# EasyEDA Pro project MSDRv2.eprj, schematic Schematic1_1
Board Name: 4xAGCV1.1; Create Date: 2025-01-03; Page Name: P1; Project Name: 4xAGCV1; Schematic Name: Schematic1; Update Date: 2025-01-03; Company: EasyEDA.com; Page Size: A4; Version: V1.0
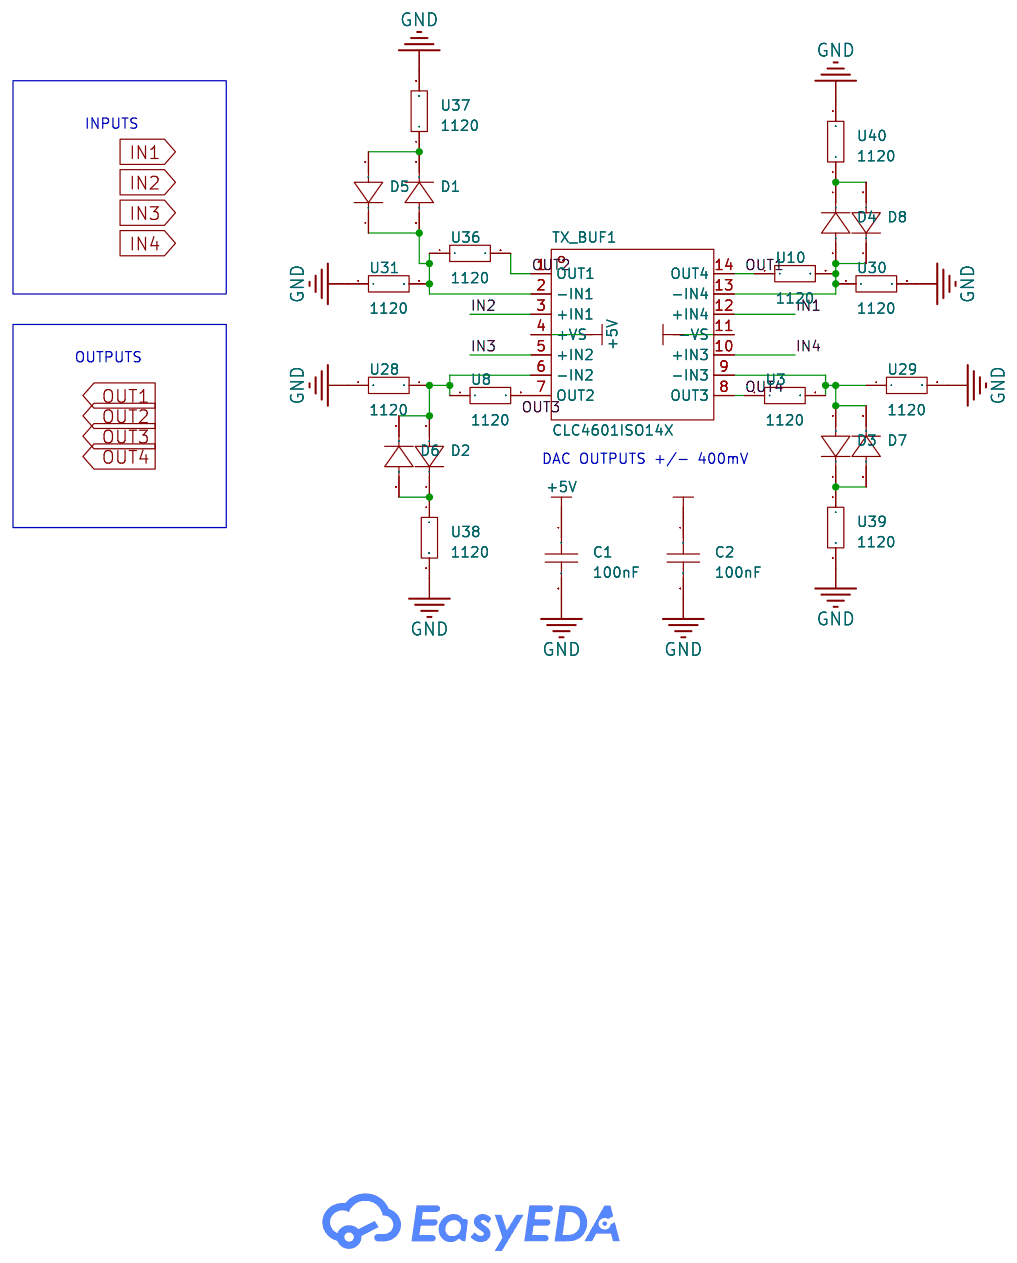
[diagram p2: schematic sheet]

## Parts
C1  100nF  [C0805]
C2  100nF  [C0805]
D1  -  [SMA_L4.4-W2.8-LS5.4-RD]
D2  -  [SMA_L4.4-W2.8-LS5.4-RD]
D3  -  [SMA_L4.4-W2.8-LS5.4-RD]
D4  -  [SMA_L4.4-W2.8-LS5.4-RD]
D5  -  [SMA_L4.4-W2.8-LS5.4-RD]
D6  -  [SMA_L4.4-W2.8-LS5.4-RD]
D7  -  [SMA_L4.4-W2.8-LS5.4-RD]
D8  -  [SMA_L4.4-W2.8-LS5.4-RD]
TX_BUF1  CLC4601ISO14X  [SOIC-14_L8.7-W3.9-P1.27-LS6.0-BL]
U3  1120  [R0805]
U8  1120  [R0805]
U10  1120  [R0805]
U28  1120  [R0805]
U29  1120  [R0805]
U30  1120  [R0805]
U31  1120  [R0805]
U36  1120  [R0805]
U37  1120  [R0805]
U38  1120  [R0805]
U39  1120  [R0805]
U40  1120  [R0805]

## Library data of the parts
C1 C2 = CAP_0805: Supplier Footprint: 0805
D1-D8 = 1N4007: Supplier Footprint: SMA(DO-214AC); Supplier Part: C727081
TX_BUF1 = CLC4601ISO14X: Number of Circuits:; Supplier Part: C49944; Supplier Footprint: SOIC-14; JLCPCB Part Class: Extended Part; Supplier: LCSC
U3 U8 U10 U28-U31 U36-U40 = 3R00: Supplier Part: C9900008006; JLCPCB Part Class: Extended Part; Supplier: LCSC

## Nets
+5V: C1.1 TX_BUF1.4(+VS)
-5V: C2.1 TX_BUF1.11(-VS)
GND: C1.2 C2.2 U28.2 U29.2 U30.2 U31.1 U37.2 U38.2 U39.2 U40.2
IN1: TX_BUF1.12(+IN4)
IN2: TX_BUF1.3(+IN1)
IN3: TX_BUF1.5(+IN2)
IN4: TX_BUF1.10(+IN3)
OUT1: TX_BUF1.14(OUT4) U10.1
OUT2: TX_BUF1.1(OUT1) U36.2
OUT3: TX_BUF1.7(OUT2) U8.2
OUT4: TX_BUF1.8(OUT3) U3.1
$1N983: D1.1(K) D5.2(A) U37.1
$1N984: D1.2(A) D5.1(K) TX_BUF1.2(-IN1) U31.2 U36.1
$1N985: D2.2(A) D6.1(K) TX_BUF1.6(-IN2) U8.1 U28.1
$1N986: D2.1(K) D6.2(A) U38.1
$1N987: D3.1(K) D7.2(A) U39.1
$1N988: D3.2(A) D7.1(K) TX_BUF1.9(-IN3) U3.2 U29.1
$1N989: D4.2(A) D8.1(K) TX_BUF1.13(-IN4) U10.2 U30.1
$1N990: D4.1(K) D8.2(A) U40.1

## Notes on the sheet
- INPUTS
- OUTPUTS
- DAC OUTPUTS +/- 400mV
